# Altium schematic sheet 12V SMPS.SchDoc
size A3; SheetNumber: 2; SheetTotal: 3
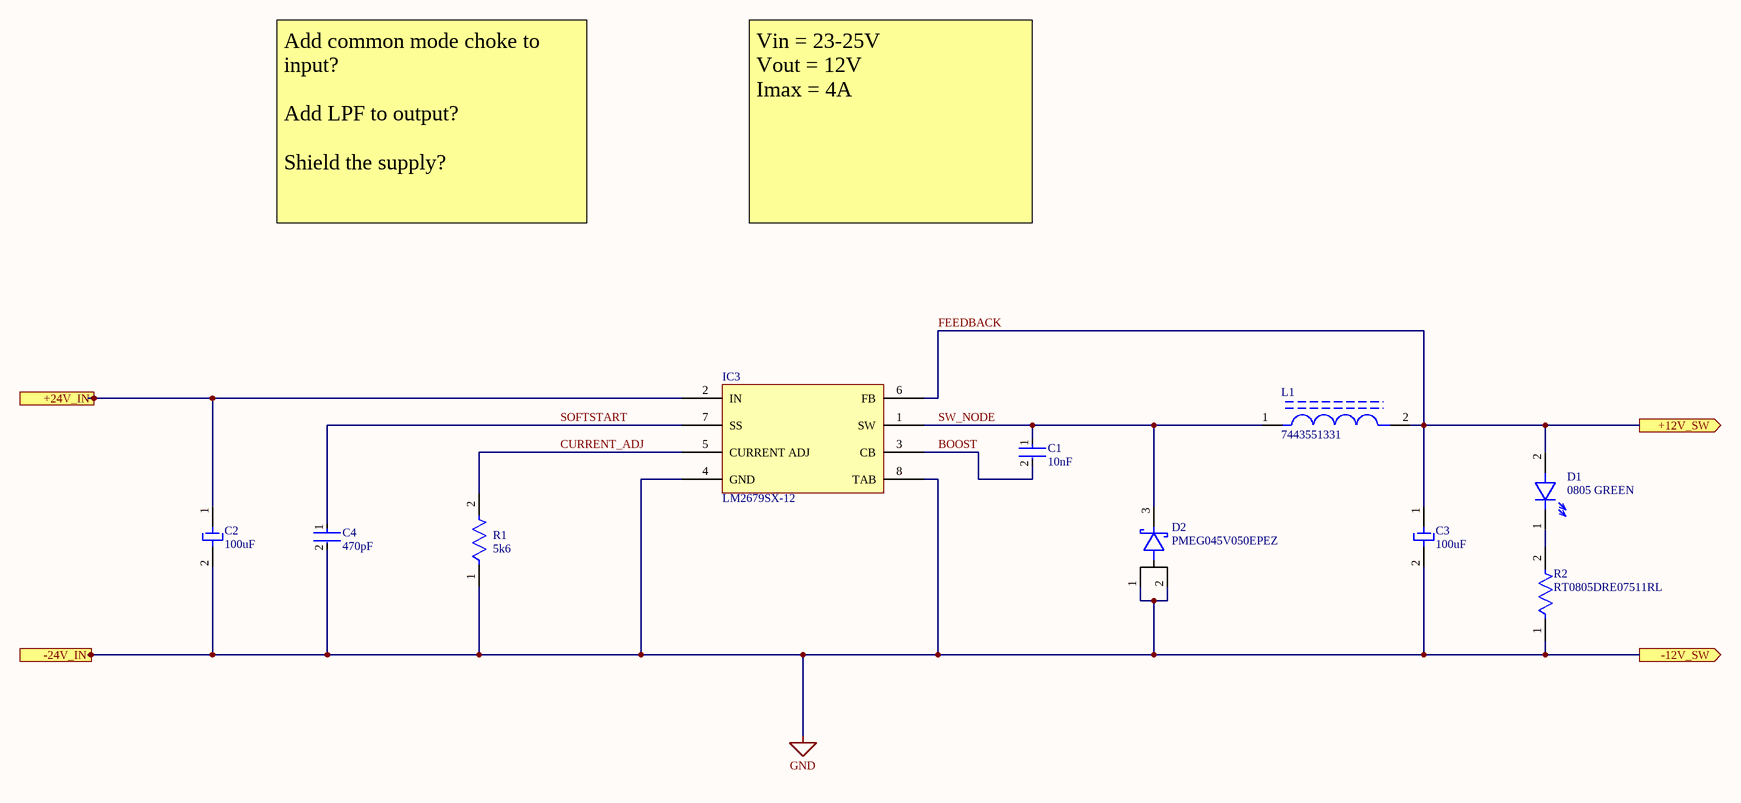
[diagram p0: 12V SMPS.SchDoc]

## Parts
C1  10nF  [FP-C0805C-DN-MFG]
C2  100uF  [AHA1010101M040R]
C3  100uF  [AHA1010101M040R]
C4  470pF  [FP-C0805C-DN-MFG]
D1  0805 GREEN  [0805 LED]
D2  PMEG045V050EPEZ  [PMEG045V050EPE]
IC3  LM2679SX-12  [TS7B_M]
L1  7443551331  [7443551331 33uH]
R1  5k6  [FP-CRCW0805-e3-IPC_A]
R2  RT0805DRE07511RL  [FP-RT0805-MFG]

## Ports
+12V_SW (out, see Callisto Control Board[2B], Pi Sensor Board[1A]), +24V_IN (in, see Callisto Control Board[1B]), -12V_SW (out, see Callisto Control Board[2B], Pi Sensor Board[1A]), -24V_IN (in, see Callisto Control Board[1B])

## Nets
GND: C2.2 C3.2 C4.2 D2.1(Anode) D2.2(Anode) IC3.4(GND) IC3.8(TAB) R1.1 R2.1 ; port -24V_IN, port -12V_SW
+24V_IN: C2.1 IC3.2(IN) ; port +24V_IN
BOOST: C1.2 IC3.3(CB)
CURRENT_ADJ: IC3.5(CURRENT_ADJ) R1.2
FEEDBACK: C3.1 D1.2(Anode) IC3.6(FB) L1.2 ; port +12V_SW
SOFTSTART: C4.1 IC3.7(SS)
SW_NODE: C1.1 D2.3(Cathode) IC3.1(SW) L1.1
NetD1_1: D1.1(Cathode) R2.2

## Notes on the sheet
- Add common mode choke to input?
  Add LPF to output?
  Shield the supply?
- Vin = 23-25V
  Vout = 12V
  Imax = 4A

## Library data of the parts
C1 = CMP-03020-003256-1: C0805 10,000 pF C0G 30ppm/°C 5.00% 50 V; Manufacturer: KEMET; Manufacturer Part Number: C0805C103J5GAC; Voltage Rating: 50 V; Material: Ceramic; Tolerance: 0.05; RoHS: TRUE; Value: 10,000 pF; Package: C0805C-DN; Automotive: No; Device Class L2: Capacitors; Device Class L1: Passive Components; Lead Free: Yes; Octopart: https://octopart.com/c0805c103j5gac-kemet-22233108; Mouser Description: Multilayer Ceramic Capacitors MLCC - SMD/SMT 50volts 0.01uF 5% C0G; Ipc Land Pattern Name: CAPC200125X78; Temperature Range Low: -55°C; Temperature Coefficient: 30ppm/°C; Temperature: -55°C to +125°C; ComponentLink2Description: Datasheet; ComponentLink2URL: https://content.kemet.com/datasheets/KEM_C1003_C0G_SMD.pdf; Height: 0.88mm; Temperature Range High: +125°C; Category: Cap; Temperature Characteristic: C0G; Device Class L3: Ceramic Capacitors; Capacitance: 10,000 pF
C2 C3 = 100uF: Kyocera AHA1010101M040R
C4 = CMP-03020-010584-1: C0805 470 pF C0G 30ppm/°C 5.00% 50 V; Manufacturer: KEMET; Manufacturer Part Number: C0805C471J5GAC; Material: Ceramic; Tolerance: 0.05; Voltage Rating: 50 V; Temperature: -55°C to +125°C; Ipc Land Pattern Name: CAPC200125X78; Automotive: No; Value: 470 pF; Capacitance: 470 pF; Temperature Range High: +125°C; Category: Cap; Lead Free: Yes; RoHS: TRUE; ComponentLink2Description: Datasheet; Temperature Coefficient: 30ppm/°C; Package: C0805C-DN; Height: 0.88mm; ComponentLink2URL: https://content.kemet.com/datasheets/KEM_C1003_C0G_SMD.pdf; Temperature Range Low: -55°C; Mouser Description: Multilayer Ceramic Capacitors MLCC - SMD/SMT 50volts 470pF 5% C0G; Temperature Characteristic: C0G; Device Class L1: Passive Components; Octopart: https://octopart.com/c0805c471j5gac-kemet-1364888; Device Class L3: Ceramic Capacitors; Device Class L2: Capacitors
D1 = 0805 LED: Wurth Electronics 150080VS75000
IC3 = LM2679SX-12: LM2679SX-12/NOPB
L1 = 7443551331: Wurth Electronics 7443551331
R1 = CMP-2001-04030-2: RES Thick Film, 5.6kΩ, 1%, 0.125W, 100ppm/°C, 0805; Resistance: 5.6kR; Voltage Rating: 150V; Max Power Dissipation: 125mW; Case Code (Imperial): 0805; Features: Automotive AEC-Q200; Composition: Thick Film; Package Quantity: 1; Mount: Surface Mount; Tolerance: 1%; Radiation Hardening: No; Length: 2mm; Case Code (Metric): 2012; Temperature Coefficient: 100ppm/°C; Power Rating: 125mW; Number of Terminations: 2; Lead Free: Lead Free; Voltage Rating (DC): 150V; Military Standard: Not; Number of Pins: 2; Height: 0.45mm; Depth: 1.25mm; Weight: 0.000194oz; Packaging: Tape and Reel; Case/Package: 0805; Contact Plating: Tin; Min Operating Temperature: -55°C; Termination: SMD/SMT; Max Operating Temperature: 155°C; Width: 1.25mm
R2 = CMP-03412-001492-1: RES SMD 511 OHM 0.5% 1/8W 0805; Manufacturer: Yageo; Voltage Rating: 150V; Power Rating: 0.125W; Value: 511Ω; Tolerance: 0.01; Temperature Coefficient: 50 ppm/°C; Ipc Land Pattern Name: RESC200125X50; Lead Free: Yes; Device Class L2: Resistors; Digikey Description: RES SMD 511 OHM 0.5% 1/8W 0805; Device Class L1: Passive Components; RoHS: TRUE; ComponentLink2Description: Datasheet; Temperature Range Low: -55°C; Temperature Range High: +155°C; Composition: Thin Film; Package: RT0805; Height: 0.6mm; ComponentLink2URL: http://www.yageo.com/documents/recent/PYu-RT_1-to-0.01_RoHS_L_9.pdf; Manufacturer Part Number: RT0805DRE07511RL; Temperature: -55°C to +155°C; Footprint Url: http://www.yageo.com/exep/pages/download/literatures/PYu-R_Mount_10.pdf; Series: RT; Device Class L3: Chip SMD Resistors; Resistance: 511Ω; Octopart: https://octopart.com/rt0805dre07511rl-yageo-1369364; Automotive: No; Category: Res